# Altium schematic sheet 3V3_to_1V8.SchDoc: 3.3V to 1.8V Converter
size B; DocumentNumber: 45; SheetNumber: 45; SheetTotal: 46
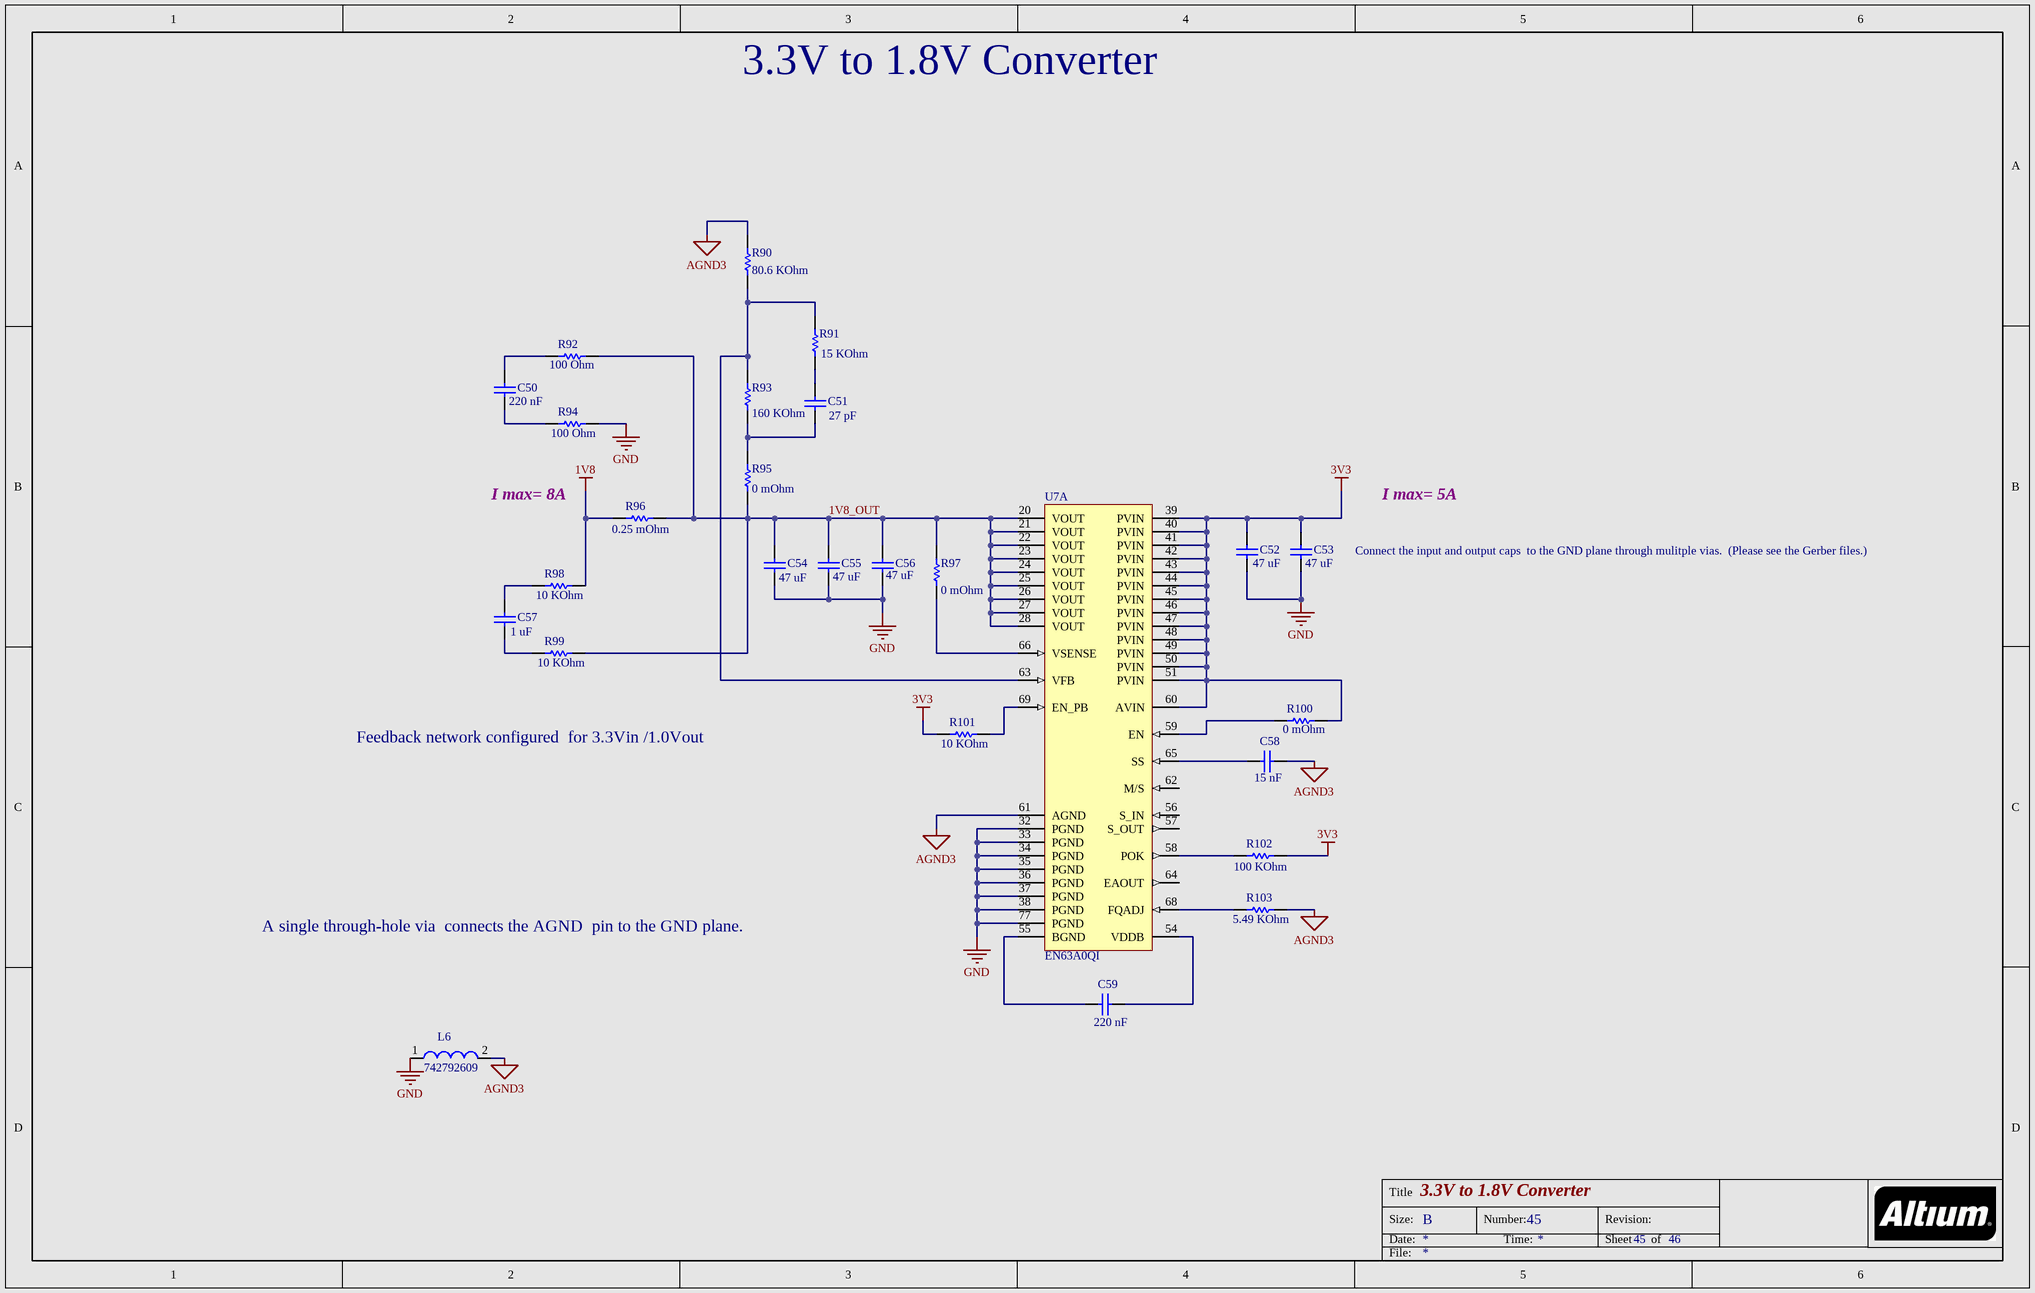
[diagram p0: 3V3_to_1V8.SchDoc]

## Parts
C50  Capacitance: 220 nF  [CAPC1005X55X25NL05T10]  (hidden comment: GRM155R61A224KE19D)
C51  Capacitance: 27 pF  [CAPC1005X55X20ML5T10]  (hidden comment: ECJ-0EC1H270J)
C52  Capacitance: 47 uF  [CAPC3216X180X20ML20]  (hidden comment: C3216X5R1A476M160AB)
C53  Capacitance: 47 uF  [CAPC3216X180X20ML20]  (hidden comment: C3216X5R1A476M160AB)
C54  Capacitance: 47 uF  [CAPC3216X180X20ML20]  (hidden comment: C3216X5R1A476M160AB)
C55  Capacitance: 47 uF  [CAPC3216X180X20ML20]  (hidden comment: C3216X5R1A476M160AB)
C56  Capacitance: 47 uF  [CAPC3216X180X20ML20]  (hidden comment: C3216X5R1A476M160AB)
C57  Capacitance: 1 uF  [CAPC1005X33X10LL5]  (hidden comment: CGB2A1X5R1E105K033BC)
C58  Capacitance: 15 nF  [CAPC1005X55X23ML05T8]  (hidden comment: VJ0402Y153JXQPW1BC)
C59  Capacitance: 220 nF  [CAPC1005X55X25NL05T10]  (hidden comment: GRM155R61A224KE19D)
L6  742792609  [SMD-0603]
R90  Resistance: 80.6 KOhm  [RESC1005X40X25ML05T05]  (hidden comment: ERJ-2RKF8062X)
R91  Resistance: 15 KOhm  [RESC1005X40X25ML05T05]  (hidden comment: ERJ-2RKF1502X)
R92  Resistance: 100 Ohm  [RESC1005X40X25LL05T05]  (hidden comment: ERJ-2RKF1000X)
R93  Resistance: 160 KOhm  [RESC1005X40X25ML05T05]  (hidden comment: CRCW0402160KFKED)
R94  Resistance: 100 Ohm  [RESC1005X40X25LL05T05]  (hidden comment: ERJ-2RKF1000X)
R95  Resistance: 0 mOhm  [RESC1005X40X25ML05T05]  (hidden comment: ERJ-2GE0R00X)
R96  Resistance: 0.25 mOhm  [STAC-CSS2725-099H_V]  (hidden comment: CSS2725FTL250)
R97  Resistance: 0 mOhm  [RESC1005X40X25ML05T05]  (hidden comment: ERJ-2GE0R00X)
R98  Resistance: 10 KOhm  [RESC1005X40X25NL05T05]  (hidden comment: ERJ-2RKF1002X)
R99  Resistance: 10 KOhm  [RESC1005X40X25NL05T05]  (hidden comment: ERJ-2RKF1002X)
R100  Resistance: 0 mOhm  [RESC1005X40X25ML05T05]  (hidden comment: ERJ-2GE0R00X)
R101  Resistance: 10 KOhm  [RESC1005X40X25NL05T05]  (hidden comment: ERJ-2RKF1002X)
R102  Resistance: 100 KOhm  [RESC1005X40X25LL05T05]  (hidden comment: ERJ-2RKF1003X)
R103  Resistance: 5.49 KOhm  [RESC1005X40X25NL05T05]  (hidden comment: ERJ-2RKF5491X)
U7  EN63A0QI  [ALTR-QFN-76_A-305_V]  (part A of 2)

## Nets
1V8: R96.1 R98.2
3V3: C52.2 C53.2 R100.1 R101.1 R102.2 U7.39(PVIN) U7.40(PVIN) U7.41(PVIN) U7.42(PVIN) U7.43(PVIN) U7.44(PVIN) U7.45(PVIN) U7.46(PVIN) U7.47(PVIN) U7.48(PVIN) U7.49(PVIN) U7.50(PVIN) U7.51(PVIN) U7.60(AVIN)
AGND3: C58.1 L6.2 R90.2 R103.2 U7.61(AGND)
GND: C52.1 C53.1 C54.1 C55.1 C56.1 L6.1 R94.1 U7.32(PGND) U7.33(PGND) U7.34(PGND) U7.35(PGND) U7.36(PGND) U7.37(PGND) U7.38(PGND) U7.77(PGND)
1V8_OUT: C54.2 C55.2 C56.2 R92.1 R95.1 R96.2 R97.2 R99.2 U7.20(VOUT) U7.21(VOUT) U7.22(VOUT) U7.23(VOUT) U7.24(VOUT) U7.25(VOUT) U7.26(VOUT) U7.27(VOUT) U7.28(VOUT)
NetC50_1: C50.1 R92.2
NetC50_2: C50.2 R94.2
NetC51_1: C51.1 R93.1 R95.2
NetC51_2: C51.2 R91.1
NetC57_1: C57.1 R99.1
NetC57_2: C57.2 R98.1
NetC58_2: C58.2 U7.65(SS)
NetC59_1: C59.1 U7.55(BGND)
NetC59_2: C59.2 U7.54(VDDB)
NetR90_1: R90.1 R91.2 R93.2 U7.63(VFB)
NetR97_1: R97.1 U7.66(VSENSE)
NetR100_2: R100.2 U7.59(EN)
NetR101_2: R101.2 U7.69(EN_PB)
NetR102_1: R102.1 U7.58(POK)
NetR103_1: R103.1 U7.68(FQADJ)

Not connected (* = marked no-connect by the designer): U7 56(S_IN) 57(S_OUT) 62(M/S) 64(EAOUT)

## Notes on the sheet
- I max= 8A
- I max= 5A
- Connect the input and output caps  to the GND plane through mulitple vias.  (Please see the Gerber files.)
- Feedback network configured  for 3.3Vin /1.0Vout
- A single through-hole via  connects the AGND  pin to the GND plane.
- Title
- Size:
- Date:
- B
- Number:
- Time:
- Revision:
- Sheet
- of
- File:

## Library data of the parts
C50 C59 = CMP-2008-04561-4: Chip Capacitor, 220 nF, +/- 10%, 10 V, -55 to 85 degC, 0402 (1005 Metric), RoHS, Tape and Reel; Manufacturer: Basic Passives; Voltage Rating: 10 V; Case\/Package: 0402; Type (Capacitors): X5R; ComponentLink1URL: http://www.murata.com/; Package Quantity: 1; Tolerance: 10%; Mounting Technology: Surface Mount; RoHSCompliant: true; PartNumber: GRM155R61A224KE19D; Max Operating Temperature: 85 degC; Case Code (Imperial): 0402; Length: 1 mm; Packaging: Tape and Reel; Min Operating Temperature: -55 degC; PackageDescription: 2-Pin Surface Mount Device, Body 1 x 0.5 mm; Height: 0.5 mm; Case Code (Metric): 1005; REACH SVHC: No SVHC; ComponentLink1Description: Manufacturer URL; Width: 0.5 mm; ComponentLink2URL: http://search.murata.co.jp/Ceramy/image/img/A01X/G101/ENG/GRM155R61A224KE19-01.pdf; Radiation Hardening: No; Pins: 2; Voltage Rating (DC): 10 V; DatasheetVersion: 03/2016; Mount: Surface Mount; PackageReference: 0402; ComponentLink2Description: Datasheet
C51 = CMP-1665-00021-1: Chip Capacitor, 27 pF, +/- 5%, 50 V, -55 to 125 degC, 0402 (1005 Metric), RoHS, Tape and Reel; Voltage Rating: 50 V; Case\/Package: 0402; Type (Capacitors): C0G; Tolerance: 5%; Min Operating Temperature: -55 degC; Max Operating Temperature: 125 degC; DatasheetVersion: 09/2008; Width: 0.02 inch; Packaging: Tape and Reel; RoHSCompliant: true; ComponentLink2URL: http://media.digikey.com/pdf/Data%20Sheets/Panasonic%20Capacitors%20PDFs/ECJ_(General).pdf; Mount: Surface Mount; ComponentLink1URL: http://www.panasonic.com/; PackageDescription: 2-Pin Surface Mount Device, Body 1 x 0.5 mm; Length: 0.039 inch; Case Code (Metric): 1005; Package Quantity: 10000; ComponentLink2Description: Datasheet; PackageReference: 0402; Height: 0.5 mm; Case Code (Imperial): 0402; Mounting Technology: Surface Mount; ComponentLink1Description: Manufacturer URL
C52-C56 = CMP-1663-00005-1: Chip Capacitor, 47 uF, +/- 20%, 10 V, -55 to 85 degC, 1206 (3216 Metric), RoHS, Tape and Reel; Voltage Rating (DC): 10 V; Type (Capacitors): X5R; Case\/Package: 1206; Tolerance: 20%; Voltage Rating: 10 V; Packaging: Tape and Reel; ComponentLink2URL: https://product.tdk.com/info/en/catalog/datasheets/mlcc_commercial_general_en.pdf; Min Operating Temperature: -55 degC; Length: 3.2 mm; Radiation Hardening: No; Mounting Technology: Surface Mount; PackageDescription: 2-Pin Surface Mount Device, Body 3.2 x 1.6 mm; Max Operating Temperature: 85 degC; Case Code (Metric): 3216; ComponentLink1URL: http://www.tdk.com/; DatasheetVersion: 03/2015; Mount: Surface Mount; Case Code (Imperial): 1206; Package Quantity: 2000; ComponentLink2Description: Datasheet; PackageReference: 3216; Height: 1.6 mm; RoHSCompliant: true; Width: 1.6 mm; ComponentLink1Description: Manufacturer URL
C57 = CMP-1663-00006-2: Chip Capacitor, 1 uF, +/- 10%, 25 V, -55 to 85 degC, 0402 (1005 Metric), RoHS, Tape and Reel; Tolerance: 10%; PackageDescription: 2-Pin Surface Mount Device, Body 1 x 0.5 mm; PartNumber: CGB2A1X5R1E105K033BC; Case Code (Metric): 1005; DatasheetVersion: 04/2015; RoHSCompliant: True; Max Operating Temperature: 85 degC; ComponentLink2URL: https://product.tdk.com/info/en/catalog/datasheets/mlcc_commercial_lowprofile_en.pdf; Package Quantity: 1; Width: 0.02 inch; Case/Package: 0402; Case Code (Imperial): 0402; Packaging: Tape and Reel; Length: 0.039 inch; Min Operating Temperature: -55 degC; Mounting Technology: Surface Mount; ComponentLink2Description: Datasheet; ComponentLink1URL: http://www.tdk.com/; ComponentLink1Description: Manufacturer URL
C58 = CMP-1666-00015-3: Chip Capacitor, 15 nF, +/- 5%, 10 V, -55 to 125 degC, 0402 (1005 Metric), RoHS, Tape and Reel; Voltage Rating (DC): 10 V; Type (Capacitors): X7R; Case\/Package: 0402; DatasheetVersion: 07/2016; ComponentLink1Description: Manufacturer URL; ComponentLink1URL: http://www.vishay.com/; PackageDescription: 2-Pin Surface Mount Device, Body 1 x 0.5 mm; ComponentLink2URL: http://www.vishay.com/docs/28548/vjw1bcbascomseries.pdf; ComponentLink2Description: Datasheet; Mounting Technology: Surface Mount; Length: 1 mm; PartNumber: VJ0402Y153JXQPW1BC; RoHSCompliant: true; Package Quantity: 50000; Min Operating Temperature: -55 degC; Case Code (Metric): 1005; Max Operating Temperature: 125 degC; Width: 0.5 mm; Tolerance: 5%; Packaging: Tape and Reel; Case Code (Imperial): 0402; Height: 0.5 mm; PackageReference: 0402; Mount: Surface Mount; Pins: 2; Voltage Rating: 10 V
L6 = CMP-0220-00193-1: SMD EMI Suppression Ferrite Bead WE-CBF, Z = 30 Ohm; Impedance: 30 Ohm; ComponentLink2URL: http://www.we-online.de/katalog/media/pdf/742792609.pdf; ComponentLink1URL: http://www.we-online.com; ComponentLink2Description: Datasheet; PackageDescription: Chip Inductor, 2-Leads, Body 1.6 x 0.8 mm; ComponentLink1Description: Manufacturer Link; PackageReference: SMD-0603; DatasheetVersion: Dec-2005; PackageVersion: 2009
R90 = CMP-2002-01074-3: Chip Resistor, 80.6 KOhm, +/- 1%, 100 mW, -55 to 155 degC, 0402 (1005 Metric), RoHS, Tape and Reel; Manufacturer: Basic Passives; Voltage Rating: 50 V; Power Rating: 100 mW; Case\/Package: 0402; REACH SVHC: No SVHC; Min Operating Temperature: -55 degC; Max Operating Temperature: 155 degC; ComponentLink1Description: Manufacturer URL; PackageDescription: 2-Pin Surface Mount Device, Body 1 x 0.5 mm; ComponentLink1URL: http://www.panasonic.com/; PartNumber: ERJ-2RKF8062X; Case Code (Metric): 1005; Packaging: Tape and Reel; Mount: Surface Mount; Tolerance: 1%; Package Quantity: 1; RoHSCompliant: true; Mounting Technology: Surface Mount; Height: 0.35 mm; Width: 0.5 mm; Case Code (Imperial): 0402; Length: 1 mm; ComponentLink2Description: Datasheet; Pins: 2; DatasheetVersion: 04/2015; ComponentLink2URL: http://industrial.panasonic.com/cdbs/www-data/pdf/RDA0000/AOA0000C86.pdf; PackageReference: 0402
R91 = CMP-2002-00694-3: Chip Resistor, 15 KOhm, +/- 1%, 100 mW, -55 to 155 degC, 0402 (1005 Metric), RoHS, Tape and Reel; Manufacturer: Basic Passives; Power Rating: 100 mW; Voltage Rating: 50 V; Case\/Package: 0402; Max Operating Temperature: 155 degC; Case Code (Imperial): 0402; Case Code (Metric): 1005; PartNumber: ERJ-2RKF1502X; Package Quantity: 10000; REACH SVHC: Yes; Width: 0.5 mm; Mount: Surface Mount; Mounting Technology: Surface Mount; Packaging: Tape and Reel; Tolerance: 1%; ComponentLink1Description: Manufacturer URL; ComponentLink1URL: http://www.panasonic.com/; Height: 0.35 mm; Length: 1 mm; PackageDescription: 2-Pin Surface Mount Device, Body 1 x 0.5 mm; Min Operating Temperature: -55 degC; RoHSCompliant: true; Pins: 2; PackageReference: 0402; DatasheetVersion: 04/2015; ComponentLink2URL: http://industrial.panasonic.com/cdbs/www-data/pdf/RDA0000/AOA0000C86.pdf; Weight: 2.8E-05oz; Radiation Hardening: No; ComponentLink2Description: Datasheet
R92 R94 = CMP-2002-00605-3: Chip Resistor, 100 Ohm, +/- 1%, 100 mW, -55 to 155 degC, 0402 (1005 Metric), RoHS, Tape and Reel; Manufacturer: Basic Passives; Voltage Rating: 50 V; Power Rating: 100 mW; Case\/Package: 0402; ComponentLink1URL: http://www.panasonic.com/; Package Quantity: 10000; Packaging: Tape and Reel; PackageDescription: 2-Pin Surface Mount Device, Body 1 x 0.5 mm; Tolerance: 1%; ComponentLink1Description: Manufacturer URL; REACH SVHC: Yes; Case Code (Imperial): 0402; Mounting Technology: Surface Mount; Min Operating Temperature: -55 degC; RoHSCompliant: true; Length: 1 mm; Width: 0.5 mm; Height: 0.35 mm; Max Operating Temperature: 155 degC; PartNumber: ERJ-2RKF1000X; Mount: Surface Mount; Case Code (Metric): 1005; Pins: 2; ComponentLink2Description: Datasheet; PackageReference: 0402; DatasheetVersion: 04/2015; Radiation Hardening: No; ComponentLink2URL: http://industrial.panasonic.com/cdbs/www-data/pdf/RDA0000/AOA0000C86.pdf
R93 = CMP-2002-08227-3: Chip Resistor, 160 KOhm, +/- 1%, 63 mW, -55 to 155 degC, 0402 (1005 Metric), RoHS, Tape and Reel; Manufacturer: Basic Passives; Power Rating: 63 mW; Voltage Rating: 50 V; Case\/Package: 0402; Tolerance: 1%; Min Operating Temperature: -55 degC; Length: 1 mm; Height: 0.35 mm; Package Quantity: 10; Mounting Technology: Surface Mount; Mount: Surface Mount; Max Operating Temperature: 155 degC; PartNumber: CRCW0402160KFKED; Case Code (Imperial): 0402; Packaging: Tape and Reel; ComponentLink1Description: Manufacturer URL; Case Code (Metric): 1005; ComponentLink1URL: http://www.vishay.com/; RoHSCompliant: true; REACH SVHC: Unknown; PackageDescription: 2-Pin Surface Mount Device, Body 1 x 0.5 mm; Width: 0.5 mm; ComponentLink2Description: Datasheet; Pins: 2; PackageReference: 0402; Weight: 2.3E-05oz; ComponentLink2URL: http://www.vishay.com/docs/20035/dcrcwe3.pdf; Radiation Hardening: No; DatasheetVersion: 06/2012
R95 R97 R100 = CMP-2002-00429-3: Chip Resistor, 0 mOhm, +/- 5%, 100 mW, -55 to 155 degC, 0402 (1005 Metric), RoHS, Tape and Reel; Manufacturer: Basic Passives; Power Rating: 100 mW; Voltage Rating: 50 V; Case\/Package: 0402; Max Operating Temperature: 155 degC; Tolerance: 5%; PartNumber: ERJ-2GE0R00X; Case Code (Imperial): 0402; Package Quantity: 10000; Length: 1 mm; Mounting Technology: Surface Mount; ComponentLink1URL: http://www.panasonic.com/; Height: 0.35 mm; Width: 0.5 mm; Min Operating Temperature: -55 degC; Case Code (Metric): 1005; RoHSCompliant: true; REACH SVHC: Unknown; ComponentLink1Description: Manufacturer URL; Packaging: Tape and Reel; Mount: Surface Mount; PackageDescription: 2-Pin Surface Mount Device, Body 1 x 0.5 mm; PackageReference: 0402; ComponentLink2URL: http://industrial.panasonic.com/cdbs/www-data/pdf/RDA0000/AOA0000C84.pdf; DatasheetVersion: 03/2015; Radiation Hardening: No; Pins: 2; ComponentLink2Description: Datasheet
R96 = CMP-1719-00001-2: Chip Resistor, 0.25 mOhm, +/- 1%, 4 W, -55 to 225 degC, 2725 (6865 Metric), RoHS, Tape and Reel; RoHSCompliant: True; ComponentLink2URL: https://www.seielect.com/catalog/SEI-CSS_CSSH.PDF; DatasheetVersion: 06/2016; Radiation Hardening: No; Packaging: Tape and Reel; Package Quantity: 1000; Max Operating Temperature: 225 degC; PackageDescription: 2-Pin Surface Mount Device, Body 6.81 x 6.45 mm; PartNumber: CSS2725FTL250; Length: 0.268 inch; Height: 0.049 inch; ComponentLink1Description: Manufacturer URL; Mounting Technology: Surface Mount; Width: 0.254 inch; ComponentLink2Description: Datasheet; ComponentLink1URL: https://www.seielect.com/; Min Operating Temperature: -55 degC; Tolerance: 1%
R98 R99 R101 = CMP-2002-00607-3: Chip Resistor, 10 KOhm, +/- 1%, 100 mW, -55 to 155 degC, 0402 (1005 Metric), RoHS, Tape and Reel; Manufacturer: Basic Passives; Voltage Rating: 50 V; Power Rating: 100 mW; Case\/Package: 0402; Case Code (Imperial): 0402; Min Operating Temperature: -55 degC; PartNumber: ERJ-2RKF1002X; Mounting Technology: Surface Mount; Length: 1 mm; Packaging: Tape and Reel; ComponentLink1Description: Manufacturer URL; Mount: Surface Mount; Package Quantity: 10000; Max Operating Temperature: 155 degC; Case Code (Metric): 1005; Height: 0.35 mm; ComponentLink1URL: http://www.panasonic.com/; Tolerance: 1%; REACH SVHC: Yes; RoHSCompliant: true; Width: 0.5 mm; PackageDescription: 2-Pin Surface Mount Device, Body 1 x 0.5 mm; Radiation Hardening: No; PackageReference: 0402; ComponentLink2Description: Datasheet; DatasheetVersion: 04/2015; ComponentLink2URL: http://industrial.panasonic.com/cdbs/www-data/pdf/RDA0000/AOA0000C86.pdf; Pins: 2
R102 = CMP-2002-00608-3: Chip Resistor, 100 KOhm, +/- 1%, 100 mW, -55 to 155 degC, 0402 (1005 Metric), RoHS, Tape and Reel; Manufacturer: Basic Passives; Voltage Rating: 50 V; Power Rating: 100 mW; Case\/Package: 0402; Height: 0.35 mm; ComponentLink1Description: Manufacturer URL; Packaging: Tape and Reel; Min Operating Temperature: -55 degC; RoHSCompliant: true; PackageDescription: 2-Pin Surface Mount Device, Body 1 x 0.5 mm; Mount: Surface Mount; Package Quantity: 10000; Max Operating Temperature: 155 degC; ComponentLink1URL: http://www.panasonic.com/; Tolerance: 1%; Mounting Technology: Surface Mount; PartNumber: ERJ-2RKF1003X; Case Code (Metric): 1005; Case Code (Imperial): 0402; REACH SVHC: Yes; Length: 1 mm; Width: 0.5 mm; DatasheetVersion: 04/2015; Pins: 2; ComponentLink2Description: Datasheet; ComponentLink2URL: http://industrial.panasonic.com/cdbs/www-data/pdf/RDA0000/AOA0000C86.pdf; PackageReference: 0402; Radiation Hardening: No
R103 = CMP-2002-00990-3: Chip Resistor, 5.49 KOhm, +/- 1%, 100 mW, -55 to 155 degC, 0402 (1005 Metric), RoHS, Tape and Reel; Manufacturer: Basic Passives; Voltage Rating: 50 V; Power Rating: 100 mW; Case\/Package: 0402; Tolerance: 1%; Packaging: Tape and Reel; RoHSCompliant: true; Length: 0.039 inch; PackageDescription: 2-Pin Surface Mount Device, Body 1 x 0.5 mm; Height: 0.016 inch; Case Code (Imperial): 0402; Min Operating Temperature: -55 degC; PartNumber: ERJ-2RKF5491X; Case Code (Metric): 1005; ComponentLink1Description: Manufacturer URL; Width: 0.02 inch; Package Quantity: 10000; ComponentLink1URL: http://www.panasonic.com/; Mount: Surface Mount; Mounting Technology: Surface Mount; REACH SVHC: Yes; Max Operating Temperature: 155 degC; ComponentLink2URL: http://industrial.panasonic.com/cdbs/www-data/pdf/RDA0000/AOA0000C86.pdf; Pins: 2; ComponentLink2Description: Datasheet; PackageReference: 0402; DatasheetVersion: 04/2015
U7 = CMP-1689-00005-3: PowerSoC Highly Integrated Synchronous Buck with Integrated Inductor, 2.5 to 6.6 V Input, -40 to 85 degC, 76-Pin QFN, RoHS, Tape and Reel; Output Current: 12 A; PartNumber: EN63A0QI; PackageVersion: Rev. A, 10/2014; ComponentLink3Description: Package Specification; ComponentLink3URL: http://wl.altera.com/literature/ds/EN63A0QA_10398.pdf; PackageDescription: 76-Pin Quad-Flat No-Leads Package, Body 11 x 10 mm, Pitch 0.5 mm, Thermal Pad 2.6x8.1mm; ComponentLink1URL: https://www.altera.com/; DatasheetVersion: Rev. H; Mounting Technology: Surface Mount; ComponentLink2Description: Datasheet; ComponentLink1Description: Manufacturer URL; ComponentLink2URL: https://www.altera.com/content/dam/altera-www/global/en_US/pdfs/literature/ds/en63a0qi_07077.pdf; Pins: 76; Min Operating Temperature: -40 degC; Length: 0.43 inch; Radiation Hardening: No; Max Operating Temperature: 85 degC; Package Quantity: 250; Width: 0.39 inch; Mount: Surface Mount; Packaging: Tape and Reel; Height: 0.12 inch; RoHSCompliant: True